# Altium schematic sheet MCU.SchDoc
size A; SheetNumber: 7; SheetTotal: 11
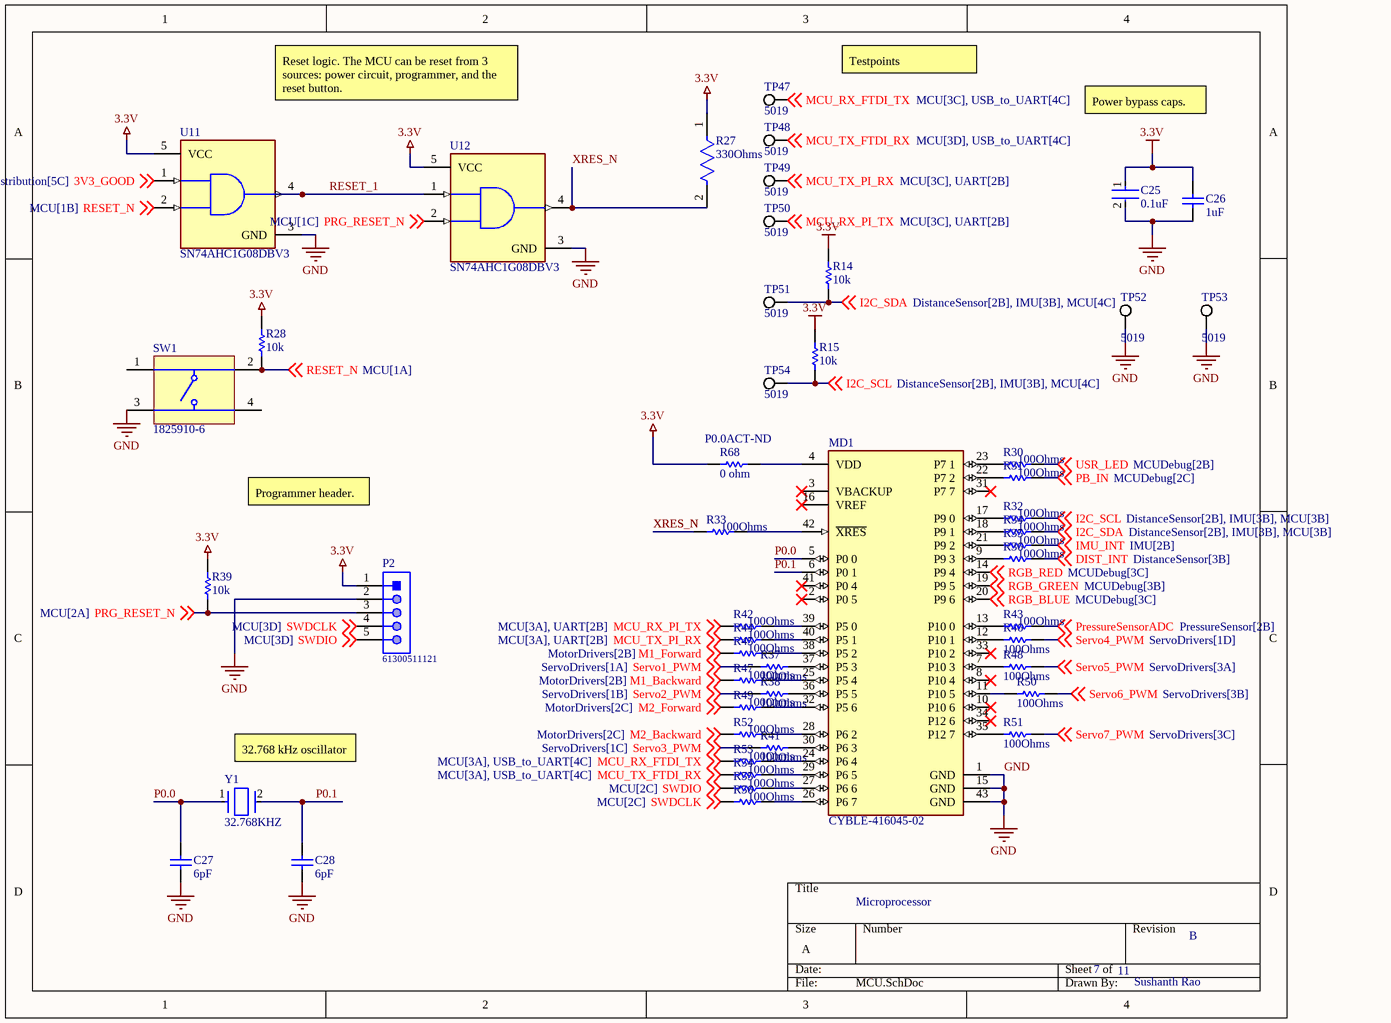
[diagram p0: MCU.SchDoc]

## Parts
C25  0.1uF  [FP-CC0805-0_85-MFG]
C26  1uF  [CAPC2013X145X50ML20T25]
C27  6pF  [CAPC2013X94X50LL20T25]
C28  6pF  [CAPC2013X94X50LL20T25]
MD1  CYBLE-416045-02  [FP-CYBLE-416045-02-MFG]
P2  61300511121  [61300511121]
R14  10k  [RESC2013X60X35NL10T20]
R15  10k  [RESC2013X60X35NL10T20]
R27  330Ohms  [FP-KTR10-IPC_C]
R28  10k  [RESC2013X60X35NL10T20]
R30  100Ohms  [RESC2013X60X35ML10T20]
R31  100Ohms  [RESC2013X60X35ML10T20]
R32  100Ohms  [RESC2013X60X35ML10T20]
R33  100Ohms  [RESC2013X60X35ML10T20]
R34  100Ohms  [RESC2013X60X35ML10T20]
R35  100Ohms  [RESC2013X60X35ML10T20]
R36  100Ohms  [RESC2013X60X35ML10T20]
R37  100Ohms  [RESC2013X60X35ML10T20]
R38  100Ohms  [RESC2013X60X35ML10T20]
R39  10k  [RESC2013X60X35NL10T20]
R41  100Ohms  [RESC2013X60X35ML10T20]
R42  100Ohms  [RESC2013X60X35ML10T20]
R43  100Ohms  [RESC2013X60X35ML10T20]
R44  100Ohms  [RESC2013X60X35ML10T20]
R45  100Ohms  [RESC2013X60X35ML10T20]
R46  100Ohms  [RESC2013X60X35ML10T20]
R47  100Ohms  [RESC2013X60X35ML10T20]
R48  100Ohms  [RESC2013X60X35ML10T20]
R49  100Ohms  [RESC2013X60X35ML10T20]
R50  100Ohms  [RESC2013X60X35ML10T20]
R51  100Ohms  [RESC2013X60X35ML10T20]
R52  100Ohms  [RESC2013X60X35ML10T20]
R53  100Ohms  [RESC2013X60X35ML10T20]
R54  100Ohms  [RESC2013X60X35ML10T20]
R55  100Ohms  [RESC2013X60X35ML10T20]
R56  100Ohms  [RESC2013X60X35ML10T20]
R68  0 ohm  Supplier Part Number 1: P0.0ACT-ND  [RESC2013X70X40NL20T20]
SW1  1825910-6  [TECO-1825910-6_V]
TP47  5019  [KSTN-5019_V]
TP48  5019  [KSTN-5019_V]
TP49  5019  [KSTN-5019_V]
TP50  5019  [KSTN-5019_V]
TP51  5019  [KSTN-5019_V]
TP52  5019  [KSTN-5019_V]
TP53  5019  [KSTN-5019_V]
TP54  5019  [KSTN-5019_V]
U11  SN74AHC1G08DBV3  [FP-DBV0005A-IPC_C]
U12  SN74AHC1G08DBV3  [FP-DBV0005A-IPC_C]
Y1  32.768KHZ  [FP-ABS07-120-MFG]

## Nets
3.3V: C25.1 C26.2 P2.1 R14.2 R15.2 R27.1 R28.2 R39.2 R68.1 U11.5(VCC) U12.5(VCC)
GND: C25.2 C26.1 C27.1 C28.1 MD1.1(GND) MD1.15(GND) MD1.43(GND) P2.2 SW1.3 TP52.1 TP53.1 U11.3(GND) U12.3(GND)
3V3_GOOD: U11.1(A) ; off-sheet 3V3_GOOD
DIST_INT: R36.2 ; off-sheet DIST_INT
I2C_SCL: R15.1 R32.2 TP54.1 ; off-sheet I2C_SCL
I2C_SDA: R14.1 R34.2 TP51.1 ; off-sheet I2C_SDA
IMU_INT: R35.2 ; off-sheet IMU_INT
M1_Backward: R47.1 ; off-sheet M1_Backward
M1_Forward: R45.1 ; off-sheet M1_Forward
M2_Backward: R52.1 ; off-sheet M2_Backward
M2_Forward: R49.1 ; off-sheet M2_Forward
MCU_RX_FTDI_TX: R53.1 TP47.1 ; off-sheet MCU_RX_FTDI_TX
MCU_RX_PI_TX: R42.1 TP50.1 ; off-sheet MCU_RX_PI_TX
MCU_TX_FTDI_RX: R54.1 TP48.1 ; off-sheet MCU_TX_FTDI_RX
MCU_TX_PI_RX: R44.1 TP49.1 ; off-sheet MCU_TX_PI_RX
P0.0: C27.2 MD1.5(P0_0) Y1.1
P0.1: C28.2 MD1.6(P0_1) Y1.2
PB_IN: R31.2 ; off-sheet PB_IN
PressureSensorADC: R43.2 ; off-sheet PressureSensorADC
PRG_RESET_N: P2.3 R39.1 U12.2(B) ; off-sheet PRG_RESET_N
RESET_1: U11.4(Y) U12.1(A)
RESET_N: R28.1 SW1.2 U11.2(B) ; off-sheet RESET_N
RGB_BLUE: MD1.20(P9_6) ; off-sheet RGB_BLUE
RGB_GREEN: MD1.19(P9_5) ; off-sheet RGB_GREEN
RGB_RED: MD1.14(P9_4) ; off-sheet RGB_RED
Servo1_PWM: R37.2 ; off-sheet Servo1_PWM
Servo2_PWM: R38.2 ; off-sheet Servo2_PWM
Servo3_PWM: R41.2 ; off-sheet Servo3_PWM
Servo4_PWM: R46.2 ; off-sheet Servo4_PWM
Servo5_PWM: R48.2 ; off-sheet Servo5_PWM
Servo6_PWM: R50.2 ; off-sheet Servo6_PWM
Servo7_PWM: R51.1 ; off-sheet Servo7_PWM
SWDCLK: P2.4 R56.1 ; off-sheet SWDCLK
SWDIO: P2.5 R55.1 ; off-sheet SWDIO
USR_LED: R30.2 ; off-sheet USR_LED
XRES_N: R27.2 R33.1 U12.4(Y)
NetMD1_4: MD1.4(VDD) R68.2
NetMD1_7: MD1.7(P10_3) R48.1
NetMD1_9: MD1.9(P9_3) R36.1
NetMD1_11: MD1.11(P10_5) R50.1
NetMD1_12: MD1.12(P10_1) R46.1
NetMD1_13: MD1.13(P10_0) R43.1
NetMD1_17: MD1.17(P9_0) R32.1
NetMD1_18: MD1.18(P9_1) R34.1
NetMD1_21: MD1.21(P9_2) R35.1
NetMD1_22: MD1.22(P7_2) R31.1
NetMD1_23: MD1.23(P7_1) R30.1
NetMD1_24: MD1.24(P6_4) R53.2
NetMD1_25: MD1.25(P5_4) R47.2
NetMD1_26: MD1.26(P6_7) R56.2
NetMD1_27: MD1.27(P6_6) R55.2
NetMD1_28: MD1.28(P6_2) R52.2
NetMD1_29: MD1.29(P6_5) R54.2
NetMD1_30: MD1.30(P6_3) R41.1
NetMD1_32: MD1.32(P5_6) R49.2
NetMD1_35: MD1.35(P12_7) R51.2
NetMD1_36: MD1.36(P5_5) R38.1
NetMD1_37: MD1.37(P5_3) R37.1
NetMD1_38: MD1.38(P5_2) R45.2
NetMD1_39: MD1.39(P5_0) R42.2
NetMD1_40: MD1.40(P5_1) R44.2
NetMD1_42: MD1.42(~{XRES}) R33.2

Not connected (* = marked no-connect by the designer): MD1 2(P0_5)* 3(VBACKUP)* 8(P10_4)* 10(P10_6)* 16(VREF)* 31(P7_7)* 33(P10_2)* 34(P12_6)* 41(P0_4)*; SW1 1 4

## Notes on the sheet
- Reset logic. The MCU can be reset from 3 sources: power circuit, programmer, and the reset button.
- Testpoints
- Power bypass caps.
- Programmer header.
- (near Y1) 32.768 kHz oscillator
- Microprocessor
- 11
- B
- Sushanth Rao

## Library data of the parts
C25 = CMP-1036-04410-2: CAP CER 0.1UF 25V X7R 0805; Manufacturer Part Number: CC0805KRX7R8BB104; Manufacturer: Yageo; Tolerance: 0.1; Material: Ceramic; Value: 100 nF; Insulation Resistance: 100GR; ComponentLink2URL: http://www.yageo.com/documents/recent/UPY-GPHC_Y5V_6.3V-to-50V_8.pdf; Category: Cap; Mouser Description: Multilayer Ceramic Capacitors MLCC - SMD/SMT 100nF 25V X7R 10%; Device Class L1: Passive Components; Footprint Url: http://www.yageo.com/exep/pages/download/literatures/UPY-C_GEN_24.pdf; Height: 0.95mm; Digikey Description: CAP CER 0.1UF 25V X7R 0805; Lead Free: Yes; Temperature Range High: +85°C; Temperature: -30°C to +85°C; Ipc Land Pattern Name: CAPC200125X85; Capacitance: 100 nF; Automotive: No; Octopart: https://octopart.com/cc0805krx7r8bb104-yageo-39467766; Device Class L2: Capacitors; Temperature Characteristic: X7R; Voltage Rating: 25 V; ComponentLink2Description: Datasheet; Temperature Range Low: -30°C; Device Class L3: Ceramic Capacitors; RoHS: TRUE; Package: CC0805-0.85; Supplier 1: Digi-Key; Supplier Part Number 1: 311-1141-1-ND; Stock 1: 1013369; Pricing 1: 1=0.11000, 10=0.07700, 50=0.04380, 100=0.03620, 500=0.02542, 1000=0.02104 (USD); Mount: Surface Mount; Case/Package: 0805; Number of Pins: 2; Case Code (Metric): 2012; Case Code (Imperial): 0805; Min Operating Temperature: -55°C; Max Operating Temperature: 125°C; Packaging: Tape and Reel; Voltage Rating (DC): 25V; Dielectric: X7R; Package Quantity: 4000; Termination: SMD/SMT; Series: CC; Resistor Type: Ceramic; Length: 2mm; Width: 1.25mm; Depth: 1.25mm; Thickness: 0.033inch; Radiation Hardening: No; RoHS Compliant: Yes; Reach SVHC Compliant: Yes; Halogen Free: Halogen Free; ComponentLink1URL: https://datasheet.ciiva.com/8034/70765-8034031.pdf?src-supplier=Element14; ComponentLink1Description: https://datasheet.ciiva.com/8034/70765-8034031.pdf?src-supplier=Element14; ComponentLink3URL: https://datasheet.ciiva.com/28450/1489800-28450789.pdf?src-supplier=Element14; ComponentLink3Description: https://datasheet.ciiva.com/28450/1489800-28450789.pdf?src-supplier=Element14; ComponentLink4URL: https://datasheet.ciiva.com/46430/1850775-46430166.pdf?src-supplier=Element14; ComponentLink4Description: https://datasheet.ciiva.com/46430/1850775-46430166.pdf?src-supplier=Element14; ComponentLink5URL: https://datasheet.ciiva.com/145/mlccorderingcode-145008.pdf?src-supplier=Digi-Key; ComponentLink5Description: https://datasheet.ciiva.com/145/mlccorderingcode-145008.pdf?src-supplier=Digi-Key; ComponentLink6URL: https://datasheet.ciiva.com/145/mlccorderingcode-145007.pdf?src-supplier=Digi-Key; ComponentLink6Description: https://datasheet.ciiva.com/145/mlccorderingcode-145007.pdf?src-supplier=Digi-Key; ComponentLink7URL: https://datasheet.ciiva.com/145/mlccorderingcode-145009.pdf?src-supplier=Digi-Key; ComponentLink7Description: https://datasheet.ciiva.com/145/mlccorderingcode-145009.pdf?src-supplier=Digi-Key; ComponentLink8URL: https://datasheet.ciiva.com/8034/1784427-8034030.pdf?src-supplier=Element14; ComponentLink8Description: https://datasheet.ciiva.com/8034/1784427-8034030.pdf?src-supplier=Element14
C26 = CMP-1036-04757-2: Part Number: CC0805ZRY5V8BB105; Manufacturer: Yageo; Voltage Rating: 25V; Tolerance: 80%; Dielectric: Y5V; Supplier 1: Digi-Key; Supplier Part Number 1: 311-1358-1-ND; Manufacturer Part Number: CC0805ZRY5V8BB105; RoHS: Yes; Category: Ceramic Capacitors; Stock 1: 286163; Pricing 1: 1=0.13000, 10=0.09000, 50=0.05100, 100=0.04230, 500=0.02966, 1000=0.02456 (USD); Mount: Surface Mount; Case/Package: 0805; Case Code (Metric): 2012; Case Code (Imperial): 0805; Weight: 0.000194oz; Min Operating Temperature: -30°C; Max Operating Temperature: 85°C; Package Quantity: 1; Capacitance: 1uF; Packaging: Tape and Reel; Voltage Rating (DC): 25V; Termination: SMD/SMT; Series: CC; Resistor Type: Ceramic; Length: 2mm; Width: 1.25mm; Height: 0.85mm; Thickness: 0.033inch; Depth: 1.25mm; Radiation Hardening: No; RoHS Compliant: Yes; Reach SVHC Compliant: Yes; Lead Free: Lead Free; Halogen Free: Halogen Free; ComponentLink1URL: https://datasheet.ciiva.com/144/mlccorderingcode-144703.pdf?src-supplier=Digi-Key; ComponentLink1Description: https://datasheet.ciiva.com/144/mlccorderingcode-144703.pdf?src-supplier=Digi-Key; ComponentLink2URL: https://datasheet.ciiva.com/26863/getdatasheetpartid-419810-26863011.pdf?src-supplier=Verical; ComponentLink2Description: https://datasheet.ciiva.com/26863/getdatasheetpartid-419810-26863011.pdf?src-supplier=Verical; ComponentLink3URL: https://datasheet.ciiva.com/28450/1132289-28450860.pdf?src-supplier=Element14; ComponentLink3Description: https://datasheet.ciiva.com/28450/1132289-28450860.pdf?src-supplier=Element14; ComponentLink4URL: https://datasheet.ciiva.com/144/mlccorderingcode-144704.pdf?src-supplier=Digi-Key; ComponentLink4Description: https://datasheet.ciiva.com/144/mlccorderingcode-144704.pdf?src-supplier=Digi-Key; ComponentLink5URL: https://datasheet.ciiva.com/144/mlccorderingcode-144705.pdf?src-supplier=Digi-Key; ComponentLink5Description: https://datasheet.ciiva.com/144/mlccorderingcode-144705.pdf?src-supplier=Digi-Key; ComponentLink6URL: https://datasheet.ciiva.com/13208/upy-gp-np0-16v-to-50v-8-13208251.pdf?src-supplier=Mouser; ComponentLink6Description: https://datasheet.ciiva.com/13208/upy-gp-np0-16v-to-50v-8-13208251.pdf?src-supplier=Mouser
C27 C28 = CMP-2007-04344-1: Manufacturer: AVX Interconnect / Elco; Part Number: 08055A6R0CAT2A
MD1 = CMP-12964-000002-1: RF TXRX MOD BLUETOOTH TRACE ANT; Manufacturer: Cypress Semiconductor; Number Of Gpio: 36; Number Of Adc Channels: 1; Max Supply Voltage: 3.6V; Min Supply Voltage: 1.71V; Data Rate: 2Mbits/s; Receiving Current: 6.7mA; Max Frequency: 2.5GHz; Bandwidth: 100MHz; Transmitting Current: 5.7mA; Interface: I2C,SPI,UART,I2S,Other; Octopart: https://octopart.com/cyble-416045-02-cypress+semiconductor-96386825; Lead Free: Yes; RoHS: TRUE; Device Class L3: Transceivers; Category: UNK; Package: 0; Device Class L2: RF Semiconductors and Devices; Automotive: No; ComponentLink2URL: https://www.cypress.com/file/428336/download; Temperature Range Low: -40°C; Height: 2mm; Device Class L1: Integrated Circuits (ICs); Manufacturer Part Number: CYBLE-416045-02; ComponentLink2Description: Datasheet; Digikey Description: RF TXRX MOD BLUETOOTH TRACE ANT; Temperature: -40°C to +85°C; Temperature Range High: +85°C
P2 = CMP-1502-01068-1: THT Vertical Pin Header WR-PHD, Pitch 2.54 mm, Single Row, 5 pins; Manufacturer: Wurth Elektronik; Pin Number: 5; Contact Resistance: 20mOhm; Working Voltage: 250VAC; Pitch: 2.54mm; Withstanding Voltage: 500VAC; Rated Current: 3A; Gender: Male; Datasheet URL: https://katalog.we-online.de/em/datasheet/6130xx11121.pdf; Orientation: Vertical; Mounting Technology: THT; Row Number: Single; Package Reference: 61300511121; Publisher: WurthElektronik; Part Number: 61300511121; Packaging: Bag; Manufacturer URL: http://www.we-online.de; Operating Temperature: -40to105degC
R14 R15 R28 R39 = CMP-1659-00013-4: Chip Resistor, 10 KOhm, +/- 1%, 0.125 W, -55 to 155 degC, 0805 (2012 Metric), RoHS, Tape and Reel; Manufacturer: Yageo; Manufacturer Part Number: RC0805FR-0710KL; Voltage Rating: 150 V; Value: 10kR; Power Rating: 125mW; Temperature Coefficient: 100ppm/°C; Mount: Surface Mount; ComponentLink1Description: Manufacturer URL; ComponentLink2URL: http://www.yageo.com/documents/recent/PYu-RC_Group_51_RoHS_L_04.pdf; Pins: 2; Length: 2 mm; Min Operating Temperature: -55 degC; Height: 0.5 mm; Mounting Technology: Surface Mount; RoHSCompliant: true; REACH SVHC: No SVHC; ComponentLink1URL: http://www.yageo.com/; Max Operating Temperature: 155 degC; PackageReference: 0805; DatasheetVersion: Rev. 4, 02/2016; Package Quantity: 5000; Packaging: Tape and Reel; ComponentLink2Description: Datasheet; PackageDescription: 2-Pin Surface Mounted Device, Body 2 x 1.25 mm; Supplier 1: Digi-Key; Supplier Part Number 1: 311-10.0KCRCT-ND; RoHS: Yes; Category: Chip SMD Resistors; Stock 1: 11227289; Pricing 1: 1=0.10000, 10=0.03300, 100=0.01340, 1000=0.00602, 2500=0.00523 (USD); Case/Package: 0805; Case Code (Imperial): 0805; Case Code (Metric): 2012; Tolerance: 1%; Termination: SMD/SMT; Series: RC; Resistance Tolerance: 1%; Resistor Type: Thick Film; Number of Terminations: 2; Max Power Dissipation: 125mW; Construction: Rectangular; Technology: THICK FILM; Features: Moisture Resistant; Width: 0.049inch; Depth: 1.25mm; Lead Free: Lead Free; RoHS Compliant: Yes; Military Standard: Not
R27 = CMP-08839-031445-1: Res Thick Film 0805 300Ω 5% 0.125W ±200ppm/°C Automotive Paper T/R; Max Power Dissipation: 125mW; Resistance: 300R; Resistor Type: Thick Film; Case Code (Metric): 2012; Length: 0.079inch; Package Quantity: 1; Case Code (Imperial): 0805; Max Operating Temperature: 155°C; Number of Terminations: 2; Features: Automotive AEC-Q200; Temperature Coefficient: 200ppm/°C; Case/Package: 0805; Tolerance: 5%; Min Operating Temperature: -55°C; Packaging: Cut Tape; Height: 0.026inch; Series: KTR; RoHS Compliant: Yes; Width: 0.049inch
R30-R38 R41-R56 = CMP-2100-03669-1: Chip Resistor, 100 Ohm, +/-1%, 0.125 W, -55 to 155 degC, 0805 (2012 Metric), RoHS, Tape and Reel; Manufacturer: Yageo; Power Rating: 125mW; Resistance: 100Ohm; Voltage Rating: 150V; Tolerance: 1%; Temperature Coefficient: 100ppm/degreesC; Length: 2mm; Package Description: 2-Pin Surface Mounted Device, Body 2 x 1.25 mm; Case Code (Imperial): 0805; Number of Pins: 2; Termination: SMD/SMT; Lead Pitch: 0.4mm; Package Quantity: 1; Height: 0.024inch; Case Code (Metric): 2012; Number of Terminations: 2; Datasheet Version: Rev. 5, 10/2016; Lead Free: LeadFree; Package Reference: 0805; Composition: ThickFilm; REACH SVHC: Unknown; Voltage Rating (DC): 150V; Min Operating Temperature: -55degC; Packaging: TapeandReel; Military Standard: Not; Case/Package: 0805; Datasheet URL: http://www.yageo.com/NewPortal/yageodocoutput?fileName=/pdf/R-Chip/PYu-RC_Group_51_RoHS_L_5.pdf; Max Operating Temperature: 155degC; Manufacturer URL: http://www.yageo.com/; Max Power Dissipation: 125mW; Width: 0.049inch; Depth: 1.25mm; RoHSCompliant: true
R68 = CMP-1665-00002-5: Chip Resistor, 0 Ohm, +/- 1%, 0.125 W, -55 to 155 degC, 0805 (2012 Metric), RoHS, Tape and Reel; PartNumber: ERJ-6GEY0R00V; Manufacturer: Panasonic; Tolerance: 5%; Value: 0R; Power Rating: 125mW; Temperature Coefficient: 600ppm/°C; Voltage Rating: 150V; Current Rating: 2A; REACH SVHC: No SVHC; Min Operating Temperature: -55 degC; Case/Package: 0805; Packaging: Tape and Reel; Package Quantity: 5000; ComponentLink1Description: Manufacturer URL; PackageDescription: 2-Pin Surface Mount Device, Body 2 x 1.25 mm; Mounting Technology: Surface Mount; Max Operating Temperature: 155 degC; Width: 1.25 mm; RoHSCompliant: True; Height: 0.6 mm; ComponentLink1URL: http://www.panasonic.com/; Resistance: 0 Ohm; ComponentLink2URL: http://industrial.panasonic.com/cdbs/www-data/pdf/RDA0000/AOA0000C84.pdf; Case Code (Imperial): 0805; DatasheetVersion: 03/2015; Length: 2 mm; Case Code (Metric): 2012; ComponentLink2Description: Datasheet; Radiation Hardening: No; Supplier 1: Digi-Key; Manufacturer Part Number: ERJ-6GEY0R00V; RoHS: Yes; Category: Chip SMD Resistors; Stock 1: 3172332; Pricing 1: 1=0.10000, 10=0.06400, 25=0.04680, 50=0.03560, 100=0.02620, 250=0.02000, 500=0.01598, 1000=0.01177 (USD); Contact Plating: Tin; Resistor Type: Thick Film; Series: ERJ; Termination: SMD/SMT; Number of Terminations: 2; Voltage Rating (DC): 150V; Construction: Rectangular; Max Power Dissipation: 125mW; Features: Automotive AEC-Q200; Technology: THICK FILM; Depth: 1.25mm; Ratings: AEC-Q200; RoHS Compliant: Yes; Lead Free: Lead Free; Military Standard: Not; Reach SVHC Compliant: Yes
SW1 = CMP-1684-00021-1: Tact Switch, SPST-NO, 0.05 A, -35 to 85 degC, 4-Pin THD, RoHS, Bulk; Manufacturer: TE Connectivity; Maximum Contact Resistance: 100mOhm; Mechanical Life: 100000Cycles; Bushing Type: Unthreaded; Switch Configuration: OFF(ON); Maximum DC Voltage Rating: 24V; Contact Rating @ Voltage: 0.05A@24VDC; Actuator Color: Black; Body Orientation: Straight; Function: MomentaryContact; Illumination: N/R; Actuator Style: RoundButton; Actuator Material: PolybutyleneTerephthalate; Dielectric Strength: 500VAC; Pole Throw Configuration: SPST; Actuator Length: 1.4mm; Product Weight: N/A; Contact Material: CopperAlloy; Housing Material: N/A; Terminal Type: PCPins; Minimum Insulation Resistance: 100MOhm; Package Description: 4-Pin Through Hole Device, Body 5.99 x 5.99 mm, Pitch 6.5 mm; Part No: 1825910-6; Package Reference: THD; Base Material: N/A; Manufacturer URL: http://www.te.com; Contact Plating: Silver; RoHS: Yes; Datasheet Version: Rev. C9; Electrical Life: 100000Cycles; Maximum AC Voltage Rating: N/A; Thread Size: N/R; Operating Temperature: -35to85C; Mounting: ThroughHole; Dimension: 5.99x5mm; Datasheet URL: http://www.te.com/commerce/DocumentDelivery/DDEController?Action=showdoc&DocId=Customer+Drawing%7F1825910%7FC9%7Fpdf%7FEnglish%7FENG_CD_1825910_C9.pdf%7F1825910-6; Family: 1825910; Seal Location: N/A; Seal Description: N/A; Packaging: N/A
TP47-TP54 = CMP-1672-00008-1: Test Point, 1 Position SMD, RoHS, Tape and Reel; Manufacturer: Keystone Electronics; Body Material: Bronze; Plating: Silver; ComponentLink1Description: Manufacturer URL; Package Quantity: 1000; DatasheetVersion: 03/2014; Packaging: Tape and Reel; ComponentLink2URL: http://www.keyelco.com/product-pdf.cfm?p=1357; ComponentLink1URL: http://www.keyelco.com/; Mount: Surface Mount; Contact Plating: Silver; PackageDescription: 1-Pin Surface Mount Device, Body 3.81 x 2.03 mm; Pins: 1; RoHSCompliant: True; Mounting Technology: Surface Mount; ComponentLink2Description: Datasheet; PackageReference: 5019; Supplier 1: Digi-Key; Supplier Part Number 1: 36-5019CT-ND; Manufacturer Part Number: 5019; RoHS: Yes; Category: Connectors; Stock 1: 1009631; Pricing 1: 1=0.34000, 25=0.27360, 100=0.22340, 250=0.20064, 500=0.19152 (USD); Number of Pins: 1; Material: Bronze; Contact Material: Bronze; Series: 5019; Termination: SMD/SMT; Height: 0.09inch; RoHS Compliant: Yes; Reach SVHC Compliant: Yes; Lead Free: Lead Free; ComponentLink3URL: https://datasheet.ciiva.com/16885/70182998-16885945.pdf?src-supplier=Allied+Electronics; ComponentLink3Description: https://datasheet.ciiva.com/16885/70182998-16885945.pdf?src-supplier=Allied+Electronics; ComponentLink4URL: https://datasheet.ciiva.com/14848/m60-2p61-14848437.pdf?src-supplier=Digi-Key; ComponentLink4Description: https://datasheet.ciiva.com/14848/m60-2p61-14848437.pdf?src-supplier=Digi-Key; ComponentLink5URL: https://datasheet.ciiva.com/14848/m60-2p61-14848438.pdf?src-supplier=Digi-Key; ComponentLink5Description: https://datasheet.ciiva.com/14848/m60-2p61-14848438.pdf?src-supplier=Digi-Key; ComponentLink6URL: https://datasheet.ciiva.com/14848/m60-2p61-14848439.pdf?src-supplier=Digi-Key; ComponentLink6Description: https://datasheet.ciiva.com/14848/m60-2p61-14848439.pdf?src-supplier=Digi-Key; ComponentLink7URL: https://datasheet.ciiva.com/16318/m60-2p61-16318395.pdf?src-supplier=Future+Electronics; ComponentLink7Description: https://datasheet.ciiva.com/16318/m60-2p61-16318395.pdf?src-supplier=Future+Electronics
U11 U12 = CMP-04903-000082-1: IC GATE AND 1CH 2-INP SOT23-5; Logic Function: AND GATE; RoHS Compliant: Yes
Y1 = CMP-2000-07587-2: CRYSTAL 32.7680KHZ 6PF SMD; Frequency Tolerance: 20ppm; Series Resistance: 60kR; ESR (Equivalent Series Resistance): 55kR; Depth: 1.5mm; Width: 0.061inch; Number of Pins: 2; Max Operating Temperature: 85°C; Length: 3.2mm; Case/Package: SMD/SMT; Series: ABS07; Lead Free: Lead Free; Min Operating Temperature: -40°C; Load Capacitance: 6pF; Packaging: Tape and Reel; Height: 0.035inch; Radiation Hardening: No; Tolerance: 20ppm; Operating Frequency: 32.768 kHz; Termination: SMD/SMT; REACH SVHC: No SVHC; RoHS Compliant: Yes; Frequency: 32.768kHz; Package Quantity: 3000; Mount: Surface Mount